# Altium project 一体机V5.PrjPcb (part 2 of 4)

## Sheet 01-USB Device.SchDoc
size A4; DocumentNumber: 21; SheetNumber: 21; SheetTotal: 34
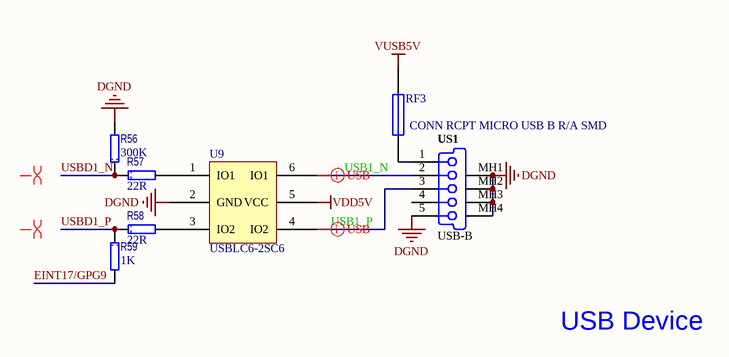
[diagram p12: 01-USB Device.SchDoc]

### Parts
R56  value 300K  [1608[0603]R]  (hidden comment: CRCW0603300KFKEA)
R57  value 22R  [1608[0603]R]  (hidden comment: CRCW060322R0FKEA)
R58  value 22R  [1608[0603]R]  (hidden comment: CRCW060322R0FKEA)
R59  value 1K  [1608[0603]R]  (hidden comment: CRCW06031K00FKEA)
RF3  0805L050WR  [2012[0805]F]  (value not drawn)
U9  USBLC6-2SC6  [SOT26A-6N]
US1  USB-B  Description 1: CONN RCPT MICRO USB B R/A SMD  [USB/SM0.8-6H5]

### Nets
DGND: R56.2 U9.2(GND) US1.5 US1.MH1 US1.MH2 US1.MH3 US1.MH4
VDD5V: U9.5(VCC)
VUSB5V: RF3.2
EINT17/GPG9: R59.2
USB1_N: U9.6(IO1) US1.2
USB1_P: U9.4(IO2) US1.3
USBD1_N: R56.1 R57.1
USBD1_P: R58.1 R59.1
NetR57_2: R57.2 U9.1(IO1)
NetR58_2: R58.2 U9.3(IO2)
NetRF3_1: RF3.1 US1.1

Not connected (* = marked no-connect by the designer): US1 4

### Layout directives
differential pair: (no net found under the mark), USB1_N, USB1_P

### Notes on the sheet
- USB Device

### Library data of the parts
R56 = RES: 厚膜电阻器 - SMD 1/10watt 300Kohms 1%; Manufacturer: Vishay / Dale; 尺寸: 0.85 mm W x 1.55 mm L x 0.45 mm H; 工作温度范围: - 55 C to + 155 C; 封装 / 箱体: 0603 (1608 metric); 封装: Reel; 功率额定值: 100 mW; 产品: Thick Film Resistors SMD; 系列: CRCW; 温度系数: 100 PPM / K; 端接类型: SMD/SMT; 电压额定值: 75 V; 外壳代码 - in: 0603; 外壳代码 - mm: 1608; 制造商: Vishay; 产品种类: 0603 Thick Film Chip Resistors; 标准包装数量: 5000; Supplier 1: Mouser; Supplier Part Number 1: 71-CRCW0603-300K-E3; Manufacturer Part Number: CRCW0603300KFKEA; RoHS: RoHS Compliant By Exemption; Category: 厚膜电阻器 - SMD; Stock 1: 19604; Pricing 1: 1=0.080, 10=0.013, 100=0.010, 1000=0.008, 5000=0.005, 25000=0.004, 50000=0.003 (USD); 电阻: 300 kOhms; 容差: 1 %; RoHS - 贸泽: E; Minimum Order Quantity: 1; Reeling: True; ComponentLink1URL: http://www.mouser.com/ds/2/427/dcrcwe3-109170.pdf; ComponentLink1Description: http://www.mouser.com/ds/2/427/dcrcwe3-109170.pdf; Description 1: 厚膜电阻器 - SMD 1/10watt 300Kohms 1%
R57 R58 = RES: 厚膜电阻器 - SMD 1/10watt 22ohms 1%; Manufacturer: Vishay / Dale; 尺寸: 0.85 mm W x 1.55 mm L x 0.45 mm H; 工作温度范围: - 55 C to + 155 C; 封装 / 箱体: 0603 (1608 metric); 封装: Reel; 功率额定值: 100 mW; 产品: Thick Film Resistors SMD; 系列: CRCW; 温度系数: 100 PPM / K; 端接类型: SMD/SMT; 电压额定值: 75 V; 制造商: Vishay; 标准包装数量: 5000; 外壳代码 - in: 0603; 外壳代码 - mm: 1608; 产品种类: 0603 Thick Film Chip Resistors; Supplier 1: Mouser; Supplier Part Number 1: 71-CRCW0603-22-E3; Manufacturer Part Number: CRCW060322R0FKEA; RoHS: RoHS Compliant By Exemption; Category: 厚膜电阻器 - SMD; Stock 1: 35802; 电阻: 22 Ohms; 容差: 1 %; Minimum Order Quantity: 1; Reeling: True; ComponentLink1URL: http://www.mouser.com/ds/2/427/dcrcwe3-109170.pdf; ComponentLink1Description: http://www.mouser.com/ds/2/427/dcrcwe3-109170.pdf; Description 1: 厚膜电阻器 - SMD 1/10watt 22ohms 1%; Pricing 1: 1=0.080, 10=0.013, 100=0.010, 1000=0.008, 5000=0.005, 25000=0.004, 50000=0.003 (USD); RoHS - 贸泽: E
R59 = RES: 厚膜电阻器 - SMD 1/10watt 1.0Kohms 1%; Manufacturer: Vishay / Dale; 尺寸: 0.85 mm W x 1.55 mm L x 0.45 mm H; 工作温度范围: - 55 C to + 155 C; 封装 / 箱体: 0603 (1608 metric); 封装: Reel; 功率额定值: 100 mW; 产品: Thick Film Resistors SMD; 电阻: 1 kOhms; 系列: CRCW; 温度系数: 100 PPM / K; 端接类型: SMD/SMT; 电压额定值: 75 V; 制造商: Vishay; 产品种类: 0603 Thick Film Chip Resistors; 标准包装数量: 5000; 外壳代码 - in: 0603; 外壳代码 - mm: 1608; Supplier 1: Mouser; Supplier Part Number 1: 71-CRCW0603-1.0K-E3; Manufacturer Part Number: CRCW06031K00FKEA; RoHS: RoHS Compliant By Exemption; Category: 厚膜电阻器 - SMD; Stock 1: 276938; Pricing 1: 1=0.080, 10=0.013, 100=0.010, 1000=0.008, 5000=0.005, 25000=0.004, 50000=0.003 (USD); 容差: 1 %; RoHS - 贸泽: E; Minimum Order Quantity: 1; Reeling: True; ComponentLink1URL: http://www.mouser.com/ds/2/427/dcrcwe3-109170.pdf; ComponentLink1Description: http://www.mouser.com/ds/2/427/dcrcwe3-109170.pdf; Description 1: 厚膜电阻器 - SMD 1/10watt 1.0Kohms 1%
RF3 = FUSE1: 可复位保险丝 PTC 30V POLY SURF MOUNT 0805 .500A; Manufacturer: Littelfuse; Resistance: 850 mOhms; Current Rating (Max): 100 A; Hold Current: 0.5 A; Maximum Voltage: 6 VDC; Trip Current: 1 A; Supplier 1: Mouser; Supplier Part Number 1: 576-0805L050; Manufacturer Part Number: 0805L050WR; RoHS: RoHS Compliant; Category: Resettable Fuses - PPTC; Stock 1: 4103; Pricing 1: 1=3.25, 10=2.61, 50=2.39, 100=2.12, 200=2.07, 500=1.74, 1000=1.49, 3000=1.40, 6000=1.35 (AUD); Dimensions: 2.2 mm L x 1.5 mm W x 1.25 mm  H; Operating Temperature Range: - 40 C to + 85 C; Package / Case: 0805 (2012 metric); Packaging: Reel; Series: 0805L; Termination Style: SMD/SMT; Type: PolyFuse Resettable PTC; Mounting Style: SMD/SMT; Product Category: Resettable PTCs; Standard Pack Qty: 3000; RoHS - Mouser: Y; Minimum Order Quantity: 1; Reeling: True; ComponentLink1URL: http://www.mouser.com/ds/2/240/Littelfuse_0805L-32472.pdf; ComponentLink1Description: http://www.mouser.com/ds/2/240/Littelfuse_0805L-32472.pdf
U9 = USBLC6-2SC6: TVS二极管阵列 ESD Protection Low Cap; Manufacturer: STMicroelectronics; 击穿电压: 6 V; 电容: 3.5 pF; 钳位电压: 17 V; 尺寸: 1.75 (Max) mm W x 3.05 (Max) mm L; 工作电压: 5 V; 封装 / 箱体: SOT-23-6; 封装: Reel; 端接类型: SMD/SMT; 通道: 2 Channels; 峰值浪涌电流: 5 A; 最大工作温度: + 125 C; 最小工作温度: - 40 C; 极性: Bidirectional; 产品种类: Voltage Protection Devices; 标准包装数量: 3000; Supplier 1: Mouser; Supplier Part Number 1: 511-USBLC6-2SC6; Manufacturer Part Number: USBLC6-2SC6; RoHS: RoHS Compliant; Description 1: TVS二极管阵列 ESD Protection Low Cap; Category: TVS二极管阵列; Stock 1: 42706; Pricing 1: 1=0.670, 10=0.590, 100=0.510, 250=0.490, 500=0.460, 1000=0.407, 3000=0.360, 6000=0.321 (USD); 系列: USBLC6-2; 安装风格: SMD/SMT; 制造商: STMicroelectronics; RoHS - 贸泽: Y; Minimum Order Quantity: 1; Reeling: True; ComponentLink1URL: http://www.st.com/web/en/resource/technical/document/datasheet/CD00050750.pdf; ComponentLink1Description: http://www.st.com/web/en/resource/technical/document/datasheet/CD00050750.pdf
US1 = D-300-0034: USB On-The-Go (OTG) Mini-B Receptacle, Right Angle, SMT, 0.80mm (.031") Pitch, Solder Tabs with Back Cover, Recessed Type; Manufacturer: TE Connectivity; Manufacturer Part Number: 1981568-1; Max Current: mA; Number of Contacts: 5; Specifications: USB 1.0; Connector type: Right Angle; Mounting Technology: Surface Mount; Status: Unreleased; Category: Connector; Supplier 1: Digi-Key; Supplier Part Number 1: A97800TR-ND; RoHS: RoHS Compliant; Stock 1: 12000; Pricing 1: 1000=0.9108, 2000=0.88044, 3000=0.85008, 5000=0.80758, 10000=0.78936 (USD); Packaging: Tape & Reel (TR); Gender: Receptacle; Mounting Type: Surface Mount, Right Angle, Horizontal; Features: -; Ingress Protection: -; ComponentLink1URL: http://www.te.com/commerce/DocumentDelivery/DDEController?Action=srchrtrv&DocNm=1981568&DocType=Customer+Drawing&DocLang=English; ComponentLink1Description: http://www.te.com/commerce/DocumentDelivery/DDEController?Action=srchrtrv&DocNm=1981568&DocType=Customer+Drawing&DocLang=English

## Sheet 06-Key.SchDoc
size A4; DocumentNumber: 27; SheetNumber: 27; SheetTotal: 34
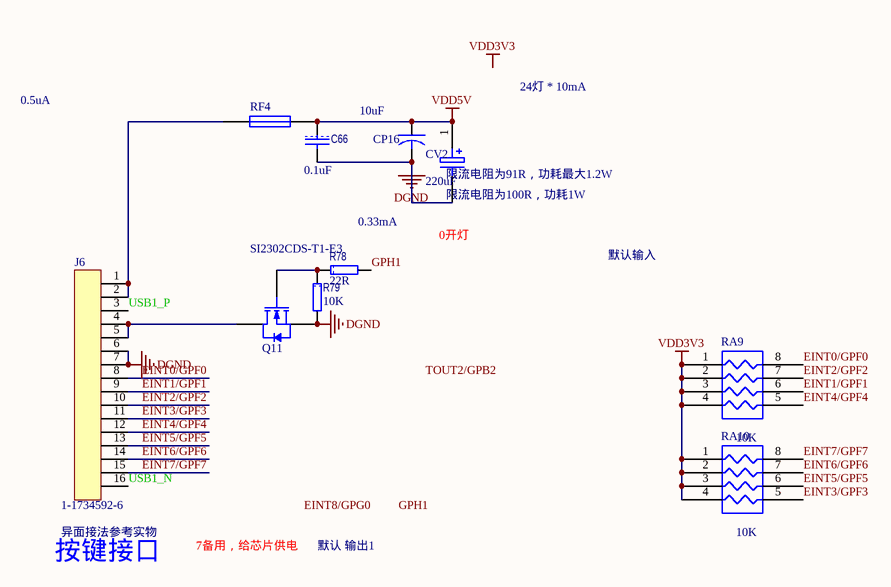
[diagram p13: 06-Key.SchDoc]

### Parts
C66  value 0.1uF  [1608[0603]C]  (hidden comment: C1608X7R1H104K)
CP16  value 10uF  [3216[1206]CB]  (hidden comment: TAJA106K016RNJ)
CV2  value 220uF  [CAPPR5-10x20/H1.1]  (hidden comment: EEU-FM1V221)
J6  1-1734592-6  [FFC/SM0.5-2H16]
Q11  SI2302CDS-T1-E3  [SOT23_N]
R78  value 22R  [1608[0603]R]  (hidden comment: CRCW060322R0FKEA)
R79  value 10K  [1608[0603]R]  (hidden comment: CRCW060310K0FKEA)
RA9  value 10K  [R-AR4]  (hidden comment: CRA06S08310K0JTA)
RA10  value 10K  [R-AR4]  (hidden comment: CRA06S08310K0JTA)
RF4  0805L050WR  [2012[0805]F]  (value not drawn)

### Nets
DGND: C66.2 CP16.2 CV2.2 J6.6 J6.7 Q11.2(S) R79.2
VDD3V3: RA9.1(R1) RA9.2(R2) RA9.3(R3) RA9.4(R4) RA10.1(R1) RA10.2(R2) RA10.3(R3) RA10.4(R4)
VDD5V: C66.1 CP16.1 CV2.1 RF4.2
EINT0/GPF0: J6.8 RA9.8(R1)
EINT1/GPF1: J6.9 RA9.6(R3)
EINT2/GPF2: J6.10 RA9.7(R2)
EINT3/GPF3: J6.11 RA10.5(R4)
EINT4/GPF4: J6.12 RA9.5(R4)
EINT5/GPF5: J6.13 RA10.6(R3)
EINT6/GPF6: J6.14 RA10.7(R2)
EINT7/GPF7: J6.15 RA10.8(R1)
GPH1: R78.2
USB1_N: J6.16
USB1_P: J6.3
NetJ6_1: J6.1 J6.2 RF4.1
NetJ6_4: J6.4 J6.5 Q11.3(D)
NetQ11_1: Q11.1(G) R78.1 R79.1

### Notes on the sheet
- 0.5uA
- 24灯 * 10mA
- (near CV2) 限流电阻为91R，功耗最大1.2W
- (near CV2) 限流电阻为100R，功耗1W
- (near R78) 0.33mA
- 0开灯
- 默认输入
- (near J6) 异面接法参考实物
- 7备用，给芯片供电
- 默认 输出1
- (near J6) 按键接口
- Labels drawn without touching a wire or pin: EINT8/GPG0, GPH1, TOUT2/GPB2, VDD3V3

### Library data of the parts
C66 = CAP: 多层陶瓷电容器MLCC - SMD/SMT 0603 0.1uF 50volts X7R 10%; Manufacturer: TDK; 产品: General Type MLCCs; 产品种类: Low & Medium Capacitance SMD Ceramic Chip Capacitors; 外壳代码 - in: 0603; 外壳代码 - mm: 1608; 封装 / 箱体: 0603 (1608 metric); 封装: Reel; 尺寸: 0.8 mm W x 1.6 mm L x 0.8 mm H; 工作温度范围: - 55 C to + 125 C; 标准包装数量: 4000; 电压额定值: 50 V; 电容-nF: 100 nF; 电容-pF: 100000 pF; 系列: C; Category: 多层陶瓷电容器MLCC - SMD/SMT; ComponentLink1Description: http://www.tdk.com/pdf/general_B11.pdf; ComponentLink1URL: http://www.tdk.com/pdf/general_B11.pdf; Description 1: 多层陶瓷电容器MLCC - SMD/SMT 0603 0.1uF 50volts X7R 10%; Manufacturer Part Number: C1608X7R1H104K; Minimum Order Quantity: 1; Pricing 1: 1=0.160, 50=0.070, 100=0.036, 500=0.019, 1000=0.013, 4000=0.010, 8000=0.009, 12000=0.008, 20000=0.007 (USD); Reeling: True; RoHS - 贸泽: Y; RoHS: RoHS Compliant; Stock 1: 224604; Supplier 1: Mouser; Supplier Part Number 1: 810-C1608X7R1H104K; 制造商: TDK; 容差: 10 %; 温度系数/代码: X7R; 电容: 0.1 uF; 端接类型: SMD/SMT
CP16 = CAPACITOR: 钽质电容器-固体SMD 16volts 10uF 10%; Manufacturer: AVX; ESR: 3 Ohms; 产品: Tantalum Solid Standard Grade - Other Various; 产品种类: SMD Tantalum Capacitors; 制造商库存号: A Case; 外壳代码 - in: 1206; 外壳代码 - mm: 3216; 封装 / 箱体: 1206 (3216 metric); 封装: Reel; 尺寸: 1.6 mm W x 3.2 mm L; 工作温度范围: - 55 C to + 125 C; 损耗因数 DF: 8; 标准包装数量: 2000; 漏泄电流: 1.6 uA; 电压额定值: 16 V; 端接类型: SMD/SMT; 系列: TAJ; 高度: 1.8 mm; Category: 钽质电容器-固体SMD; ComponentLink1Description: http://www.avx.com/docs/Catalogs/taj.pdf; ComponentLink1URL: http://www.avx.com/docs/Catalogs/taj.pdf; Description 1: 钽质电容器-固体SMD 16volts 10uF 10%; Manufacturer Part Number: TAJA106K016RNJ; Minimum Order Quantity: 1; Pricing 1: 1=0.600, 100=0.280, 200=0.250, 500=0.221, 1000=0.200, 2000=0.140, 5000=0.131, 10000=0.124, 25000=0.103 (USD); Reeling: True; RoHS - 贸泽: Y; RoHS: RoHS Compliant; Stock 1: 20335; Supplier 1: Mouser; Supplier Part Number 1: 581-TAJA106K016R; 制造商: AVX; 容差: 10 %; 电容: 10 uF
CV2 = ELECTRO1: 插针 铝质电解电容器 - 带引线 220UF 35V ELECT FM RADIAL; Manufacturer: Panasonic Electronic Components; Manufacturer Part Number: EEU-FM1V471; Description 1: 铝质电解电容器 - 带引线 470UF 35V ELECT FM RADIAL; 电容: 470 uF; 工作温度范围: - 40 C to + 105 C; 封装: Bulk; 产品: General Purpose Electrolytic Capacitors; 容差: 20 %; 外壳直径: 10 mm; 外壳长度: 20 mm; 引线间隔: 5 mm; 制造商: Panasonic; 标准包装数量: 200; Supplier 1: Mouser; Supplier Part Number 1: 667-EEU-FM1V471; RoHS: RoHS Compliant; Category: 铝质电解电容器 - 带引线; Stock 1: 8429; Pricing 1: 1=0.300, 25=0.281, 100=0.258, 250=0.238, 500=0.230, 1000=0.226, 2000=0.216, 5000=0.200 (USD); 系列: FM; 端接类型: Radial; 电压额定值: 35 V; RoHS - 贸泽: Y; Minimum Order Quantity: 1; Reeling: False; ComponentLink1URL: http://www.mouser.com/ds/2/315/ABA0000CE108-5973.pdf; ComponentLink1Description: http://www.mouser.com/ds/2/315/ABA0000CE108-5973.pdf
J6 = 16PIN: TE CONNECTIVITY / AMP - 1-1734592-6 - FFC/FPC CONNECTOR, RECEPTACLE 16POS 1ROW; Pitch Spacing: 0.5; No. of Contacts: 16; No. of Rows: 1; FFC / FPC Thickness: 0.3; Contact Termination: Surface Mount Right Angle; Supplier 1: Newark; Supplier Part Number 1: 16R9533; Manufacturer: TE CONNECTIVITY / AMP; Manufacturer Part Number: 1-1734592-6; RoHS: YES; Description 1: TE CONNECTIVITY / AMP - 1-1734592-6 - FFC/FPC CONNECTOR, RECEPTACLE 16POS 1ROW; Stock 1: 219; Pricing 1: 1=0.383, 25=0.383, 50=0.383, 100=0.328, 500=0.328, 1000=0.328, 2500=0.297 (USD); Series: -; Gender: Receptacle; Contact Plating: Gold; ComponentLink1URL: http://www.tycoelectronics.com/commerce/DocumentDelivery/DDEController?Action=srchrtrv&DocNm=1-1773440-6&DocType=Data+Sheet&DocLang=English; ComponentLink1Description: http://www.tycoelectronics.com/commerce/DocumentDelivery/DDEController?Action=srchrtrv&DocNm=1-1773440-6&DocType=Data+Sheet&DocLang=English; ComponentLink2URL: http://www.farnell.com/cad/1650059.pdf; ComponentLink2Description: http://www.farnell.com/cad/1650059.pdf; ComponentLink3URL: http://www.farnell.com/datasheets/1665333.pdf; ComponentLink3Description: http://www.farnell.com/datasheets/1665333.pdf
Q11 = 2N7002: MOSFET 20V 2.9A 0.86W 57mohm @ 4.5V; Manufacturer: Vishay / Siliconix; 配置: Single; 封装 / 箱体: SOT-23-3; 封装: Reel; 漏极连续电流: 2.6 A; 闸/源击穿电压: +/- 8 V; 安装风格: SMD/SMT; 功率耗散: 710 mW; 电阻汲极/源极 RDS（导通）: 0.057 Ohms; 晶体管极性: N-Channel; 下降时间: 7 ns; 制造商: Vishay; 最大工作温度: + 150 C; 最小工作温度: - 55 C; 产品种类: N-Channel MOSFETs; 标准包装数量: 3000; 典型关闭延迟时间: 30 ns; Supplier 1: Mouser; Supplier Part Number 1: 781-SI2302CDS-E3; Manufacturer Part Number: SI2302CDS-T1-E3; RoHS: RoHS Compliant; Description 1: MOSFET 20V 2.9A 0.86W 57mohm @ 4.5V; Category: MOSFET; Stock 1: 51301; Pricing 1: 1=0.150, 10=0.140, 100=0.130, 250=0.125, 500=0.120, 1000=0.115, 3000=0.110, 6000=0.105, 12000=0.100 (USD); 汲极/源极击穿电压: 20 V; 上升时间: 7 ns; RoHS - 贸泽: Y; Minimum Order Quantity: 1; Reeling: True; ComponentLink1URL: http://www.vishay.com/doc?68645; ComponentLink1Description: http://www.vishay.com/doc?68645
R78 = RES: as R57 on sheet 01-USB Device; Supplier 1: Mouser; Supplier Part Number 1: 71-CRCW0603-22-E3; Manufacturer Part Number: CRCW060322R0FKEA; RoHS: RoHS Compliant By Exemption; Category: 厚膜电阻器 - SMD; Stock 1: 35802; 电阻: 22 Ohms; 容差: 1 %; Minimum Order Quantity: 1; Reeling: True; ComponentLink1URL: http://www.mouser.com/ds/2/427/dcrcwe3-109170.pdf; ComponentLink1Description: http://www.mouser.com/ds/2/427/dcrcwe3-109170.pdf; Description 1: 厚膜电阻器 - SMD 1/10watt 22ohms 1%; Pricing 1: 1=0.080, 10=0.013, 100=0.010, 1000=0.008, 5000=0.005, 25000=0.004, 50000=0.003 (USD); RoHS - 贸泽: E
R79 = RES: 厚膜电阻器 - SMD 1/10watt 10Kohms 1%; Manufacturer: Vishay / Dale; 尺寸: 0.85 mm W x 1.55 mm L x 0.45 mm H; 工作温度范围: - 55 C to + 155 C; 封装 / 箱体: 0603 (1608 metric); 封装: Reel; 功率额定值: 100 mW; 产品: Thick Film Resistors SMD; 系列: CRCW; 温度系数: 100 PPM / K; 端接类型: SMD/SMT; 电压额定值: 75 V; 制造商: Vishay; 产品种类: 0603 Thick Film Chip Resistors; 标准包装数量: 5000; 外壳代码 - in: 0603; 外壳代码 - mm: 1608; Supplier 1: Mouser; Supplier Part Number 1: 71-CRCW0603-10K-E3; Manufacturer Part Number: CRCW060310K0FKEA; RoHS: RoHS Compliant By Exemption; Category: 厚膜电阻器 - SMD; Stock 1: 0; Pricing 1: 1=0.080, 10=0.013, 100=0.010, 1000=0.008, 5000=0.005, 25000=0.004, 50000=0.003 (USD); 电阻: 10 kOhms; 容差: 1 %; RoHS - 贸泽: E; Minimum Order Quantity: 1; Reeling: True; ComponentLink1URL: http://www.mouser.com/ds/2/427/dcrcwe3-109170.pdf; ComponentLink1Description: http://www.mouser.com/ds/2/427/dcrcwe3-109170.pdf; Description 1: 厚膜电阻器 - SMD 1/10watt 10Kohms 1%
RA9 RA10 = RP4R: 电阻器网络与阵列 8Term 10Kohms 5% Convex; Manufacturer: Vishay / Dale; 尺寸: 1.5 mm W x 1.6 mm L x 0.5 mm H; 工作温度范围: - 55 C to + 150 C; 封装: Reel; 系列: CRA06; 温度系数: 200 PPM / K; 端接类型: SMD/SMT; 电路类型: Isolated; 管脚数量: 8; 电阻器数量: 4; 引线间隔: 0.8 mm; 制造商: Vishay; 产品种类: Thick Film Resistor Arrays; 产品类型: Arrays; Supplier 1: Mouser; Supplier Part Number 1: 71-CRA06S-J-10K; Manufacturer Part Number: CRA06S08310K0JTA; RoHS: RoHS Compliant By Exemption; Description 1: 电阻器网络与阵列 8Term 10Kohms 5% Convex; Category: 电阻器网络与阵列; Stock 1: 11624; Pricing 1: 1=0.090, 100=0.080, 500=0.070, 1000=0.056, 5000=0.051, 10000=0.050, 25000=0.044 (USD); 容差: 5 %; 电阻数值: 10 kOhms; RoHS - 贸泽: E; Minimum Order Quantity: 1; Reeling: True; ComponentLink1URL: http://www.mouser.com/ds/2/427/cra06es-73101.pdf; ComponentLink1Description: http://www.mouser.com/ds/2/427/cra06es-73101.pdf
RF4 = FUSE1: 可复位保险丝 PTC 30V POLY SURF MOUNT 0805.500A; Manufacturer: Littelfuse; Resistance: 850 mOhms; Current Rating (Max): 100 A; Hold Current: 0.5 A; Maximum Voltage: 6 VDC; Trip Current: 1 A; Supplier 1: Mouser; Supplier Part Number 1: 576-0805L050; Manufacturer Part Number: 0805L050WR; RoHS: RoHS Compliant; Category: Resettable Fuses - PPTC; Stock 1: 4103; Pricing 1: 1=3.25, 10=2.61, 50=2.39, 100=2.12, 200=2.07, 500=1.74, 1000=1.49, 3000=1.40, 6000=1.35 (AUD); Dimensions: 2.2 mm L x 1.5 mm W x 1.25 mm  H; Operating Temperature Range: - 40 C to + 85 C; Package / Case: 0805 (2012 metric); Packaging: Reel; Series: 0805L; Termination Style: SMD/SMT; Type: PolyFuse Resettable PTC; Mounting Style: SMD/SMT; Product Category: Resettable PTCs; Standard Pack Qty: 3000; RoHS - Mouser: Y; Minimum Order Quantity: 1; Reeling: True; ComponentLink1URL: http://www.mouser.com/ds/2/240/Littelfuse_0805L-32472.pdf; ComponentLink1Description: http://www.mouser.com/ds/2/240/Littelfuse_0805L-32472.pdf

## Sheet 08-IIC.SchDoc
size A4; DocumentNumber: 29; SheetNumber: 29; SheetTotal: 34
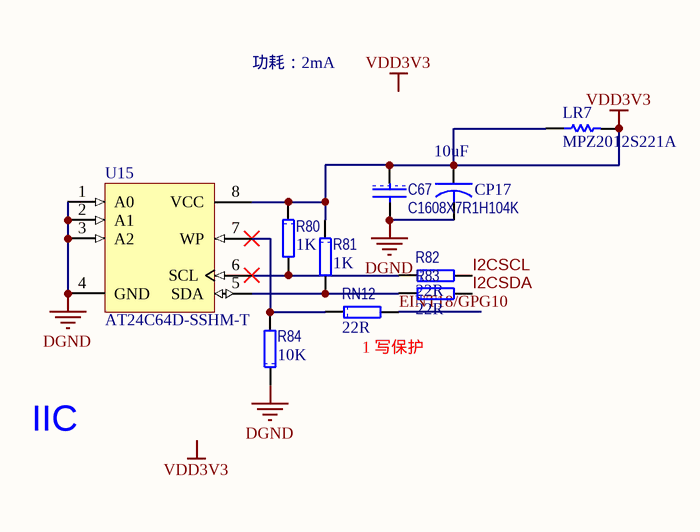
[diagram p14: 08-IIC.SchDoc]

### Parts
C67  C1608X7R1H104K  [1608[0603]C]
CP17  value 10uF  [3216[1206]CB]  (hidden comment: TAJA106K016RNJ)
LR7  MPZ2012S221A  [2012[0805]]
R80  value 1K  [1608[0603]R]  (hidden comment: CRCW06031K00FKEA)
R81  value 1K  [1608[0603]R]  (hidden comment: CRCW06031K00FKEA)
R82  value 22R  [1608[0603]R]  (hidden comment: CRCW060322R0FKEA)
R83  value 22R  [1608[0603]R]  (hidden comment: CRCW060322R0FKEA)
R84  value 10K  [1608[0603]R]  (hidden comment: CRCW060310K0FKEA)
RN12  value 22R  [1608[0603]RN]  (hidden comment: CRCW060322R0FKEA)
U15  AT24C64D-SSHM-T  [SOIC8_N]

### Nets
DGND: C67.2 CP17.2 R84.1 U15.1(A0) U15.2(A1) U15.3(A2) U15.4(GND)
VDD3V3: C67.1 CP17.1 LR7.1 LR7.2 R80.1 R81.1 U15.8(VCC)
EINT18/GPG10: RN12.2
I2CSCL: R82.2
I2CSDA: R83.2
NetR80_2: R80.2 R82.1 U15.6(SCL)
NetR81_2: R81.2 R83.1 U15.5(SDA)
NetR84_2: R84.2 RN12.1 U15.7(WP)

### Notes on the sheet
- 功耗：2mA
- (near RN12) 1 写保护
- IIC
- Labels drawn without touching a wire or pin: VDD3V3

### Library data of the parts
C67 = CAP: as C66 on sheet 06-Key; Value: 0.1uF; Category: 多层陶瓷电容器MLCC - SMD/SMT; ComponentLink1Description: http://www.tdk.com/pdf/general_B11.pdf; ComponentLink1URL: http://www.tdk.com/pdf/general_B11.pdf; Description 1: 多层陶瓷电容器MLCC - SMD/SMT 0603 0.1uF 50volts X7R 10%; Manufacturer Part Number: C1608X7R1H104K; Minimum Order Quantity: 1; Pricing 1: 1=0.160, 50=0.070, 100=0.036, 500=0.019, 1000=0.013, 4000=0.010, 8000=0.009, 12000=0.008, 20000=0.007 (USD); Reeling: True; RoHS - 贸泽: Y; RoHS: RoHS Compliant; Stock 1: 224604; Supplier 1: Mouser; Supplier Part Number 1: 810-C1608X7R1H104K; 制造商: TDK; 容差: 10 %; 温度系数/代码: X7R; 电容: 0.1 uF; 端接类型: SMD/SMT
CP17 = CAPACITOR: as CP16 on sheet 06-Key; Category: 钽质电容器-固体SMD; ComponentLink1Description: http://www.avx.com/docs/Catalogs/taj.pdf; ComponentLink1URL: http://www.avx.com/docs/Catalogs/taj.pdf; Description 1: 钽质电容器-固体SMD 16volts 10uF 10%; Manufacturer Part Number: TAJA106K016RNJ; Minimum Order Quantity: 1; Pricing 1: 1=0.600, 100=0.280, 200=0.250, 500=0.221, 1000=0.200, 2000=0.140, 5000=0.131, 10000=0.124, 25000=0.103 (USD); Reeling: True; RoHS - 贸泽: Y; RoHS: RoHS Compliant; Stock 1: 20335; Supplier 1: Mouser; Supplier Part Number 1: 581-TAJA106K016R; 制造商: AVX; 容差: 10 %; 电容: 10 uF
LR7 = Res Semi: 电磁干扰滤波珠子、扼流圈和阵列 Ferrite Chip Beads; Manufacturer: TDK; 阻抗: 220 Ohms; 最大直流电流: 3 A; 最大直流电阻: 0.04 Ohms; 工作温度范围: - 55 C to + 125 C; 封装 / 箱体: 2012; 封装: Reel; 端接类型: SMD/SMT; 容差: 25 %; 产品种类: Ferrite Beads; 标准包装数量: 4000; Supplier 1: Mouser; Supplier Part Number 1: 810-MPZ2012S221A; Manufacturer Part Number: MPZ2012S221A; RoHS: RoHS Compliant; Description 1: 电磁干扰滤波珠子、扼流圈和阵列 Ferrite Chip Beads; Category: 电磁干扰滤波珠子、扼流圈和阵列; Stock 1: 26540; Pricing 1: 1=0.070, 50=0.060, 100=0.053, 500=0.040, 1000=0.035, 4000=0.031, 8000=0.029, 12000=0.025 (USD); 制造商: TDK; RoHS - 贸泽: Y; Minimum Order Quantity: 1; Reeling: True; ComponentLink1URL: http://www.mouser.com/ds/2/400/e9413_mpz-24582.pdf; ComponentLink1Description: http://www.mouser.com/ds/2/400/e9413_mpz-24582.pdf
R80 R81 = RES: as R59 on sheet 01-USB Device; Supplier 1: Mouser; Supplier Part Number 1: 71-CRCW0603-1.0K-E3; Manufacturer Part Number: CRCW06031K00FKEA; RoHS: RoHS Compliant By Exemption; Category: 厚膜电阻器 - SMD; Stock 1: 276938; Pricing 1: 1=0.080, 10=0.013, 100=0.010, 1000=0.008, 5000=0.005, 25000=0.004, 50000=0.003 (USD); 容差: 1 %; RoHS - 贸泽: E; Minimum Order Quantity: 1; Reeling: True; ComponentLink1URL: http://www.mouser.com/ds/2/427/dcrcwe3-109170.pdf; ComponentLink1Description: http://www.mouser.com/ds/2/427/dcrcwe3-109170.pdf; Description 1: 厚膜电阻器 - SMD 1/10watt 1.0Kohms 1%
R82 R83 RN12 = RES: as R57 on sheet 01-USB Device; Supplier 1: Mouser; Supplier Part Number 1: 71-CRCW0603-22-E3; Manufacturer Part Number: CRCW060322R0FKEA; RoHS: RoHS Compliant By Exemption; Category: 厚膜电阻器 - SMD; Stock 1: 35802; 电阻: 22 Ohms; 容差: 1 %; Minimum Order Quantity: 1; Reeling: True; ComponentLink1URL: http://www.mouser.com/ds/2/427/dcrcwe3-109170.pdf; ComponentLink1Description: http://www.mouser.com/ds/2/427/dcrcwe3-109170.pdf; Description 1: 厚膜电阻器 - SMD 1/10watt 22ohms 1%; Pricing 1: 1=0.080, 10=0.013, 100=0.010, 1000=0.008, 5000=0.005, 25000=0.004, 50000=0.003 (USD); RoHS - 贸泽: E
R84 = RES: as R79 on sheet 06-Key; Supplier 1: Mouser; Supplier Part Number 1: 71-CRCW0603-10K-E3; Manufacturer Part Number: CRCW060310K0FKEA; RoHS: RoHS Compliant By Exemption; Category: 厚膜电阻器 - SMD; Stock 1: 0; Pricing 1: 1=0.080, 10=0.013, 100=0.010, 1000=0.008, 5000=0.005, 25000=0.004, 50000=0.003 (USD); 电阻: 10 kOhms; 容差: 1 %; RoHS - 贸泽: E; Minimum Order Quantity: 1; Reeling: True; ComponentLink1URL: http://www.mouser.com/ds/2/427/dcrcwe3-109170.pdf; ComponentLink1Description: http://www.mouser.com/ds/2/427/dcrcwe3-109170.pdf; Description 1: 厚膜电阻器 - SMD 1/10watt 10Kohms 1%
U15 = AT24C02BN-SP25-T: 电可擦除可编程只读存储器 64K 2-WIRE 1.7V; Manufacturer: Atmel; Description 1: 电可擦除可编程只读存储器 SERIAL 电可擦除可编程只读存储器 64K 2-WIRE 1.7V; 访问时间: 550 ns; 存储容量: 64 Kbit; 组织: 8192 x 8; 封装 / 箱体: SOIC-8; 封装: Reel; 接口类型: 2-Wire Serial; 安装风格: SMD/SMT; 工作电流: 0.4 mA; 数据保留: 100 yr; 最大时钟频率: 1000 kHz; 最大工作电流: 1 mA; 最大工作温度: + 85 C; 最小工作温度: - 40 C; 工作电源电压: 1.7 V to 5.5 V; 标准包装数量: 4000; 电源电压-最大: 5.5 V; Supplier 1: Mouser; Supplier Part Number 1: 556-AT24C64D-SSHM-T; Manufacturer Part Number: AT24C64D-SSHM-T; RoHS: RoHS Compliant; Category: 电可擦除可编程只读存储器; Stock 1: 1653; Pricing 1: 1=0.580, 10=0.480, 25=0.364, 100=0.329, 1000=0.324, 4000=0.324 (USD); 制造商: Atmel; 电源电压-最小: 1.7 V; RoHS - 贸泽: Y; Minimum Order Quantity: 1; Reeling: True; ComponentLink1URL: http://www.mouser.com/ds/2/36/doc8717-54521.pdf; ComponentLink1Description: http://www.mouser.com/ds/2/36/doc8717-54521.pdf

## Sheet 11-SPI.SchDoc
size A4; DocumentNumber: 24; SheetNumber: 24; SheetTotal: 34
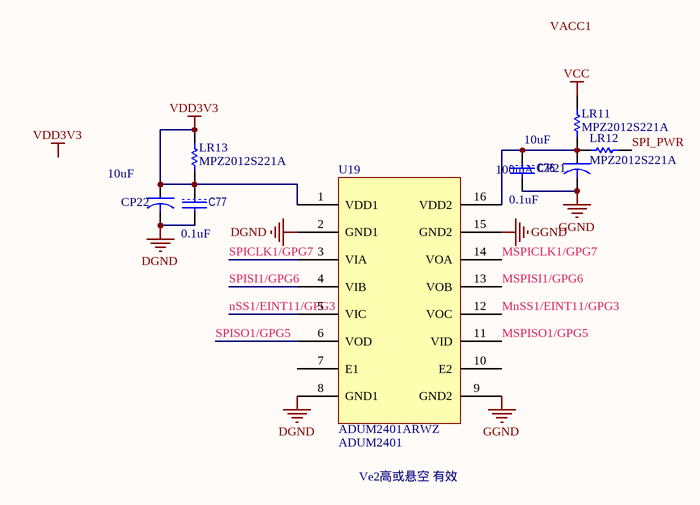
[diagram p15: 11-SPI.SchDoc]

### Parts
C76  value 0.1uF  [1608[0603]C]  (hidden comment: C1608X7R1H104K)
C77  value 0.1uF  [1608[0603]C]  (hidden comment: C1608X7R1H104K)
CP21  value 10uF  [3216[1206]CB]  (hidden comment: TAJA106K016RNJ)
CP22  value 10uF  [3216[1206]CB]  (hidden comment: TAJA106K016RNJ)
LR11  MPZ2012S221A  [2012[0805]]
LR12  MPZ2012S221A  [2012[0805]]
LR13  MPZ2012S221A  [2012[0805]]
U19  ADUM2401ARWZ  [SOIC16W_N]

### Nets
DGND: C77.2 CP22.2 U19.2(GND1) U19.8(GND1)
GGND: C76.2 CP21.2 U19.9(GND2) U19.15(GND2)
VCC: LR11.2
VDD3V3: C77.1 CP22.1 LR13.1 LR13.2 U19.1(VDD1)
MnSS1/EINT11/GPG3: U19.12(VOC)
MSPICLK1/GPG7: U19.14(VOA)
MSPISI1/GPG6: U19.13(VOB)
MSPISO1/GPG5: U19.11(VID)
nSS1/EINT11/GPG3: U19.5(VIC)
SPI_PWR: LR12.1  [project net P8_6]
SPICLK1/GPG7: U19.3(VIA)
SPISI1/GPG6: U19.4(VIB)
SPISO1/GPG5: U19.6(VOD)
NetC76_1: C76.1 CP21.1 LR11.1 LR12.2 U19.16(VDD2)

Not connected (* = marked no-connect by the designer): U19 7(E1) 10(E2)

### Notes on the sheet
- (near C76) 100mA
- Ve2高或悬空 有效
- Labels drawn without touching a wire or pin: VACC1, VDD3V3

### Library data of the parts
C76 C77 = CAP: as C66 on sheet 06-Key; Category: 多层陶瓷电容器MLCC - SMD/SMT; ComponentLink1Description: http://www.tdk.com/pdf/general_B11.pdf; ComponentLink1URL: http://www.tdk.com/pdf/general_B11.pdf; Description 1: 多层陶瓷电容器MLCC - SMD/SMT 0603 0.1uF 50volts X7R 10%; Manufacturer Part Number: C1608X7R1H104K; Minimum Order Quantity: 1; Pricing 1: 1=0.160, 50=0.070, 100=0.036, 500=0.019, 1000=0.013, 4000=0.010, 8000=0.009, 12000=0.008, 20000=0.007 (USD); Reeling: True; RoHS - 贸泽: Y; RoHS: RoHS Compliant; Stock 1: 224604; Supplier 1: Mouser; Supplier Part Number 1: 810-C1608X7R1H104K; 制造商: TDK; 容差: 10 %; 温度系数/代码: X7R; 电容: 0.1 uF; 端接类型: SMD/SMT
CP21 CP22 = CAPACITOR: as CP16 on sheet 06-Key; Category: 钽质电容器-固体SMD; ComponentLink1Description: http://www.avx.com/docs/Catalogs/taj.pdf; ComponentLink1URL: http://www.avx.com/docs/Catalogs/taj.pdf; Description 1: 钽质电容器-固体SMD 16volts 10uF 10%; Manufacturer Part Number: TAJA106K016RNJ; Minimum Order Quantity: 1; Pricing 1: 1=0.600, 100=0.280, 200=0.250, 500=0.221, 1000=0.200, 2000=0.140, 5000=0.131, 10000=0.124, 25000=0.103 (USD); Reeling: True; RoHS - 贸泽: Y; RoHS: RoHS Compliant; Stock 1: 20335; Supplier 1: Mouser; Supplier Part Number 1: 581-TAJA106K016R; 制造商: AVX; 容差: 10 %; 电容: 10 uF
LR11-LR13 = Res Semi: as LR7 on sheet 08-IIC; Supplier 1: Mouser; Supplier Part Number 1: 810-MPZ2012S221A; Manufacturer Part Number: MPZ2012S221A; RoHS: RoHS Compliant; Description 1: 电磁干扰滤波珠子、扼流圈和阵列 Ferrite Chip Beads; Category: 电磁干扰滤波珠子、扼流圈和阵列; Stock 1: 26540; Pricing 1: 1=0.070, 50=0.060, 100=0.053, 500=0.040, 1000=0.035, 4000=0.031, 8000=0.029, 12000=0.025 (USD); 制造商: TDK; RoHS - 贸泽: Y; Minimum Order Quantity: 1; Reeling: True; ComponentLink1URL: http://www.mouser.com/ds/2/400/e9413_mpz-24582.pdf; ComponentLink1Description: http://www.mouser.com/ds/2/400/e9413_mpz-24582.pdf
U19 = ADuM2401: ADuM2401 1IN 3OUT; Manufacturer: Analog Devices; Isolation Voltage: 846 V; Supply Current: 0.53 mA; Number of Channels: 4 Channel; Number of Input Lines: 3; Maximum Data Rate: 1 Mbps; Propagation Delay Time: 32 ns; Supply Voltage - Max: 5.5 V; Supply Voltage - Min: 2.7 V; Product Status: New at Mouser; Supplier 1: Mouser; Manufacturer Part Number: ADUM2401ARWZ; RoHS: RoHS Compliant; Category: Isolator Interface IC; Stock 1: 339; Pricing 1: 1=9.54, 10=8.59, 25=7.82, 50=7.29, 100=7.06, 250=6.48, 500=5.91, 1000=5.16, 2500=5.09 (AUD); Package / Case: SOIC-16; Packaging: Tube; Mounting Style: SMD/SMT; Maximum Operating Temperature: + 105 C; Minimum Operating Temperature: - 40 C; Standard Pack Qty: 47; RoHS - Mouser: Y; Minimum Order Quantity: 1; Reeling: False; ComponentLink1URL: http://www.analog.com/static/imported-files/data_sheets/ADuM2400_2401_2402.pdf; ComponentLink1Description: http://www.analog.com/static/imported-files/data_sheets/ADuM2400_2401_2402.pdf; Supplier Part Number 1: 584-ADUM2401ARWZ; Series: ADUM2401

## Sheet GPS总图.SchDoc
size A4; DocumentNumber: 20; SheetNumber: 20; SheetTotal: 34
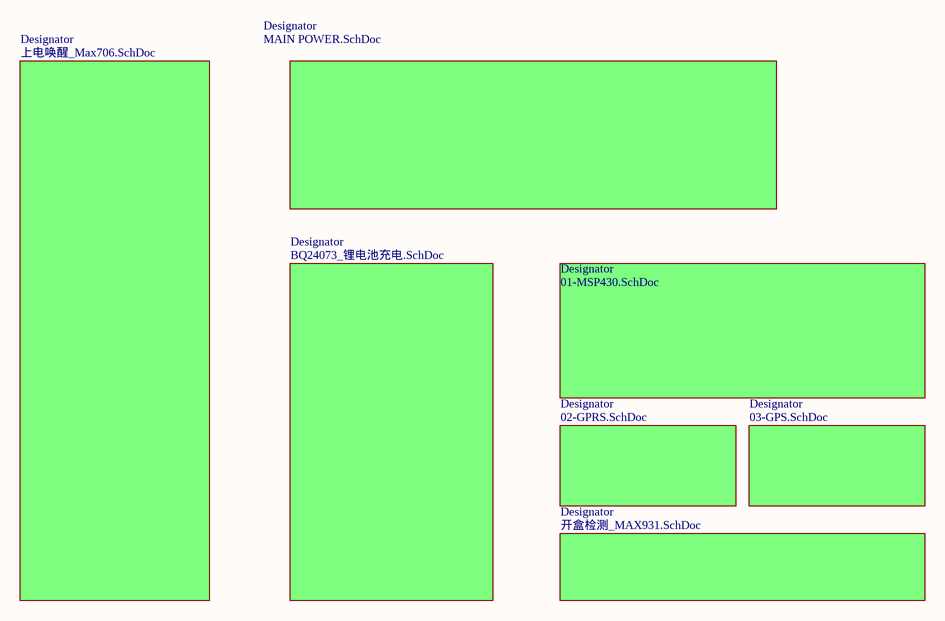
[diagram p16: GPS总图.SchDoc]

### Sub-sheets
Designator = 01-MSP430.SchDoc: no entries
Designator = 02-GPRS.SchDoc: no entries
Designator = 03-GPS.SchDoc: no entries
Designator = BQ24073_锂电池充电.SchDoc: no entries
Designator = 开盒检测_MAX931.SchDoc: no entries
Designator = MAIN POWER.SchDoc: no entries
Designator = 上电唤醒_Max706.SchDoc: no entries

## Sheet 01-MSP430.SchDoc
size A4; DocumentNumber: 17; SheetNumber: 17; SheetTotal: 34
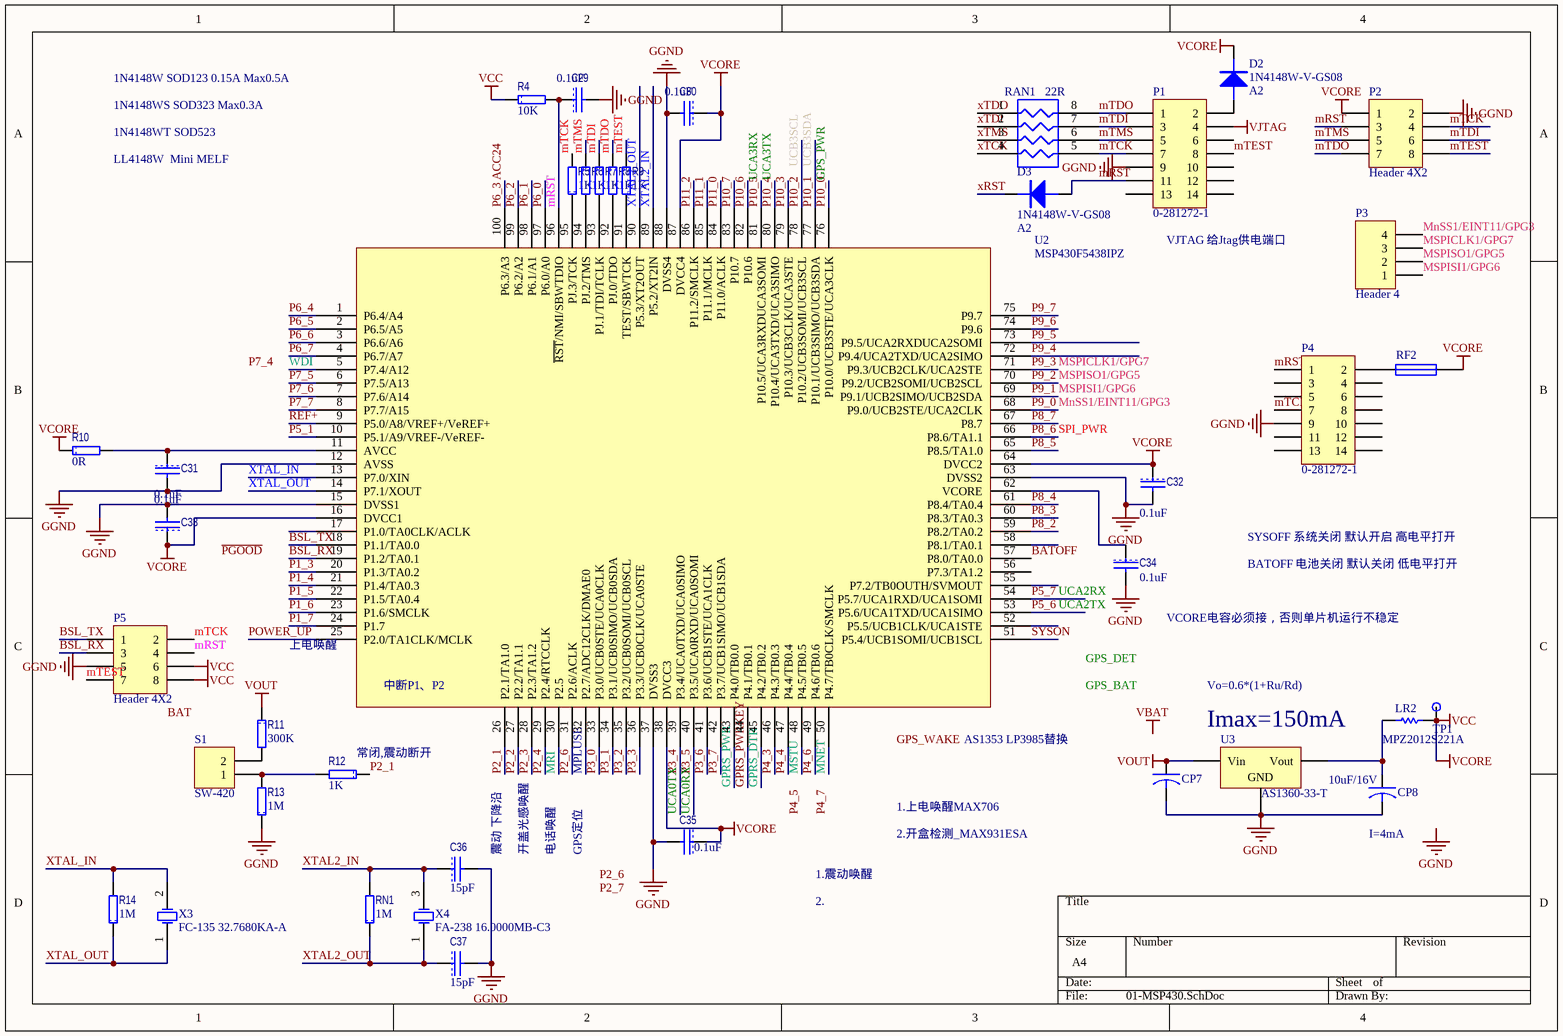
[diagram p17: 01-MSP430.SchDoc]

### Parts
C29  value 0.1uF  [1608[0603]C]  (hidden comment: C1608X7R1H104K)
C30  value 0.1uF  [1608[0603]C]  (hidden comment: C1608X7R1H104K)
C31  value 0.1uF  [1608[0603]C]  (hidden comment: C1608X7R1H104K)
C32  value 0.1uF  [1608[0603]C]  (hidden comment: C1608X7R1H104K)
C33  value 0.1uF  [1608[0603]C]  (hidden comment: C1608X7R1H104K)
C34  value 0.1uF  [1608[0603]C]  (hidden comment: C1608X7R1H104K)
C35  value 0.1uF  [1608[0603]C]  (hidden comment: C1608X7R1H104K)
C36  value 15pF  [1608[0603]]  (hidden comment: C1608C0G1H150J)
C37  value 15pF  [1608[0603]]  (hidden comment: C1608C0G1H150J)
CP7  TAJA106K016RNJ  [3216[1206]CB]  (value not drawn)
CP8  value 10uF/16V  [3216[1206]CB]  (hidden comment: TAJA106K016RNJ)
D2  1N4148W-V-GS08  value A2  [SOD123]
D3  1N4148W-V-GS08  value A2  [SOD123]
LR2  MPZ2012S221A  [2012[0805]]
P1  0-281272-1  [HDR2X7]
P2  Header 4X2  [HDR2X4]
P3  Header 4  [HDR1X4]
P4  0-281272-1  [HDR2X7]
P5  Header 4X2  [HDR2X4]
R4  value 10K  [1608[0603]R]  (hidden comment: CRCW060310K0FKEA)
R5  value 1K  [1608[0603]R]  (hidden comment: CRCW06031K00FKEA)
R6  value 1K  [1608[0603]R]  (hidden comment: CRCW06031K00FKEA)
R7  value 1K  [1608[0603]R]  (hidden comment: CRCW06031K00FKEA)
R8  value 1K  [1608[0603]R]  (hidden comment: CRCW06031K00FKEA)
R9  value 1K  [1608[0603]R]  (hidden comment: CRCW06031K00FKEA)
R10  value 0R  [1608[0603]R]  (hidden comment: CRCW06030000ZSTA)
R11  value 300K  [1608[0603]R]  (hidden comment: CRCW0603300KFKEA)
R12  value 1K  [1608[0603]R]  (hidden comment: CRCW06031K00FKEA)
R13  value 1M  [1608[0603]R]  (hidden comment: CRCW06031M00FKEA)
R14  value 1M  [1608[0603]R]  (hidden comment: CRCW06031M00FKEA)
RAN1  value 22R  [R-AR4]  (hidden comment: CRA06S08322R0JTA)
RF2  0805L050WR  [2012[0805]F]  (value not drawn)
RN1  value 1M  [1608[0603]RN]  (hidden comment: CRCW06031M00FKEA)
S1  SW-420  [SW-420]
TP1  TP  [TP]  (value not drawn)
U2  MSP430F5438IPZ  [TQFP100_N]
U3  AS1360-33-T  [SOT23_N]
X3  FC-135 32.7680KA-A  [FC-135]
X4  FA-238 16.0000MB-C3  [FA-238]

### Nets
GGND: C29.2 C30.2 C31.2 C32.2 C33.2 C34.2 C35.2 C36.2 C37.2 CP7.2 CP8.2 P1.9 P2.2 P4.9 P5.5 R13.1 U2.12(AVSS) U2.15(DVSS1) U2.37(DVSS3) U2.63(DVSS2) U2.88(DVSS4) U3.1(GND)
VCC: C30.1 C32.1 C33.1 C35.1 D2.2(K) LR2.1 P2.1 P5.6 P5.8 R4.1 R10.1 RF2.2 TP1.1(TestPoint) U2.16(DVCC1) U2.38(DVCC3) U2.64(DVCC2) U2.87(DVCC4)  [also labelled VCORE]
VJTAG: P1.4
VOUT: CP7.1 R11.1 U3.3(Vin)
ACC24: U2.100(P6.3/A3)  [also labelled P6_3]
BATOFF: U2.57(P8.0/TA0.0)
BSL_RX: P5.3 U2.19(P1.2/TA0.1)
BSL_TX: P5.1 U2.18(P1.1/TA0.0)
GPRS_DTR: U2.45(P4.2/TB0.2)
GPRS_PWR: U2.43(P4.0/TB0.0)
GPRS_PWRKEY: U2.44(P4.1/TB0.1)
GPS_PWR: U2.76(P10.0/UCB3STE/UCA3CLK)  [also labelled P10_0]
MNET: U2.50(P4.7/TB0CLK/SMCLK)
MnSS1/EINT11/GPG3: P3.4 U2.68(P9.0/UCB2STE/UCA2CLK)  [also labelled P9_0]
MPLUSE: U2.32(P2.7/ADC12CLK/DMAE0)
MRI: U2.30(P2.5)
mRST: C29.1 D3.1(A) P1.11 P2.3 P4.1 P5.4 R4.2 U2.96(~{RST}/NMI/SBWTDIO)
MSPICLK1/GPG7: P3.3 U2.71(P9.3/UCB2CLK/UCA2STE)  [also labelled P9_3]
MSPISI1/GPG6: P3.1 U2.69(P9.1/UCB2SIMO/UCB2SDA)  [also labelled P9_1]
MSPISO1/GPG5: P3.2 U2.70(P9.2/UCB2SOMI/UCB2SCL)  [also labelled P9_2]
MSTU: U2.48(P4.5/TB0.5)
mTCK: P1.7 P2.4 P4.7 P5.2 R5.2 RAN1.5(R4)
mTDI: P1.3 P2.6 R7.1 RAN1.7(R2)
mTDO: P1.1 P2.7 R8.1 RAN1.8(R1)
mTEST: P1.8 P2.8 P5.7 R9.1
mTMS: P1.5 P2.5 R6.1 RAN1.6(R3)
P1_3: U2.20(P1.3/TA0.2)
P1_4: U2.21(P1.4/TA0.3)
P1_5: U2.22(P1.5/TA0.4)
P1_6: U2.23(P1.6/SMCLK)
P1_7: U2.24(P1.7)
P2_1: R12.1 U2.26(P2.1/TA1.0)
P2_2: U2.27(P2.2/TA1.1)
P2_3: U2.28(P2.3/TA1.2)
P2_4: U2.29(P2.4/RTCCLK)
P2_6: U2.31(P2.6/ACLK)
P3_0: U2.33(P3.0/UCB0STE/UCA0CLK)
P3_1: U2.34(P3.1/UCB0SIMO/UCB0SDA)
P3_2: U2.35(P3.2/UCB0SOMI/UCB0SCL)
P3_3: U2.36(P3.3/UCB0CLK/UCA0STE)
P3_4: U2.39(P3.4/UCA0TXD/UCA0SIMO)  [also labelled UCA0TX]
P3_5: U2.40(P3.5/UCA0RXD/UCA0SOMI)  [also labelled UCA0RX]
P3_6: U2.41(P3.6/UCB1STE/UCA1CLK)
P3_7: U2.42(P3.7/UCB1SIMO/UCB1SDA)
P4_3: U2.46(P4.3/TB0.3)
P4_4: U2.47(P4.4/TB0.4)
P4_6: U2.49(P4.6/TB0.6)
P5_1: U2.10(P5.1/A9/VREF-/VeREF-)
P5_6: U2.53(P5.6/UCA1TXD/UCA1SIMO)  [also labelled UCA2TX]
P5_7: U2.54(P5.7/UCA1RXD/UCA1SOMI)  [also labelled UCA2RX]
P6_0: U2.97(P6.0/A0)
P6_1: U2.98(P6.1/A1)
P6_2: U2.99(P6.2/A2)
P6_4: U2.1(P6.4/A4)
P6_5: U2.2(P6.5/A5)
P6_6: U2.3(P6.6/A6)
P6_7: U2.4(P6.7/A7)
P7_5: U2.6(P7.5/A13)
P7_6: U2.7(P7.6/A14)
P7_7: U2.8(P7.7/A15)
P8_2: U2.59(P8.2/TA0.2)
P8_3: U2.60(P8.3/TA0.3)
P8_4: U2.61(P8.4/TA0.4)
P8_5: U2.65(P8.5/TA1.0)
P8_6: U2.66(P8.6/TA1.1)  [also labelled SPI_PWR]
P8_7: U2.67(P8.7)
P9_4: U2.72(P9.4/UCA2TXD/UCA2SIMO)
P9_5: U2.73(P9.5/UCA2RXDUCA2SOMI)
P9_6: U2.74(P9.6)
P9_7: U2.75(P9.7)
P10_1: U2.77(P10.1/UCB3SIMO/UCB3SDA)  [also labelled UCB3SDA]
P10_2: U2.78(P10.2/UCB3SOMI/UCB3SCL)  [also labelled UCB3SCL]
P10_3: U2.79(P10.3/UCB3CLK/UCA3STE)
P10_4: U2.80(P10.4/UCA3TXD/UCA3SIMO)  [also labelled UCA3TX]
P10_5: U2.81(P10.5/UCA3RXDUCA3SOMI)  [also labelled UCA3RX]
P10_6: U2.82(P10.6)
P10_7: U2.83(P10.7)
P11_0: U2.84(P11.0/ACLK)
P11_1: U2.85(P11.1/MCLK)
P11_2: U2.86(P11.2/SMCLK)
POWER_UP: U2.25(P2.0/TA1CLK/MCLK)
REF+: U2.9(P5.0/A8/VREF+/VeREF+)
SYSON: U2.51(P5.4/UCB1SOMI/UCB1SCL)
WDI: U2.5(P7.4/A12)
xRST: D3.2(K)
XTAL2_IN: C36.1 RN1.2 U2.89(P5.2/XT2IN) X4.3(OSC2)
XTAL2_OUT: C37.1 RN1.1 U2.90(P5.3/XT2OUT) X4.1(OSC1)
XTAL_IN: R14.2 U2.13(P7.0/XIN) X3.2(OSC2)
XTAL_OUT: R14.1 U2.14(P7.1/XOUT) X3.1(OSC1)
xTCK: RAN1.4(R4)
xTDI: RAN1.2(R2)
xTDO: RAN1.1(R1)
xTMS: RAN1.3(R3)
NetC31_1: C31.1 R10.2 U2.11(AVCC)
NetC34_1: C34.1 U2.62(VCORE)
NetCP8_1: CP8.1 LR2.2 U3.2(Vout)
NetD2_1: D2.1(A) P1.2
NetR5_1: R5.1 U2.95(PJ.3/TCK)
NetR6_2: R6.2 U2.94(PJ.2/TMS)
NetR7_2: R7.2 U2.93(PJ.1/TDI/TCLK)
NetR8_2: R8.2 U2.92(PJ.0/TDO)
NetR9_2: R9.2 U2.91(TEST/SBWTCK)
NetR11_2: R11.2 S1.2
NetR12_2: R12.2 R13.2 S1.1

Not connected (* = marked no-connect by the designer): P1 6 10 12 13 14; P4 2 3 4 5 6 8 10 11 12 13 14; RF2 1; U2 17(P1.0/TA0CLK/ACLK) 52(P5.5/UCB1CLK/UCA1STE) 55(P7.2/TB0OUTH/SVMOUT) 56(P7.3/TA1.2) 58(P8.1/TA0.1)

### Notes on the sheet
- 1N4148W SOD123 0.15A Max0.5A
- 1N4148WS SOD323 Max0.3A
- 1N4148WT SOD523
- LL4148W  Mini MELF
- (near P1) VJTAG 给Jtag供电端口
- BATOFF 电池关闭 默认关闭 低电平打开
- SYSOFF 系统关闭 默认开启 高电平打开
- (near U2) 上电唤醒
- VCORE电容必须接，否则单片机运行不稳定
- (near U2) 中断P1、P2
- Vo=0.6*(1+Ru/Rd)
- (near R12) 常闭,震动断开
- (near U2) AS1353 LP3985替换
- (near U3) Imax=150mA
- (near C36) 震动 下降沿
- 开盖光感唤醒
- 电话唤醒
- GPS定位
- 1.上电唤醒MAX706
- 2.开盒检测_MAX931ESA
- (near CP8) I=4mA
- 1.震动唤醒
- 2.
- Labels drawn without touching a wire or pin: BAT, GGND, GPS_BAT, GPS_DET, GPS_WAKE, P2_6, P2_7, P4_5, P4_7, P7_4, VBAT, ~{PGOOD}

### Library data of the parts
C29-C35 = CAP: as C66 on sheet 06-Key; Category: 多层陶瓷电容器MLCC - SMD/SMT; ComponentLink1Description: http://www.tdk.com/pdf/general_B11.pdf; ComponentLink1URL: http://www.tdk.com/pdf/general_B11.pdf; Description 1: 多层陶瓷电容器MLCC - SMD/SMT 0603 0.1uF 50volts X7R 10%; Manufacturer Part Number: C1608X7R1H104K; Minimum Order Quantity: 1; Pricing 1: 1=0.160, 50=0.070, 100=0.036, 500=0.019, 1000=0.013, 4000=0.010, 8000=0.009, 12000=0.008, 20000=0.007 (USD); Reeling: True; RoHS - 贸泽: Y; RoHS: RoHS Compliant; Stock 1: 224604; Supplier 1: Mouser; Supplier Part Number 1: 810-C1608X7R1H104K; 制造商: TDK; 容差: 10 %; 温度系数/代码: X7R; 电容: 0.1 uF; 端接类型: SMD/SMT
C36 C37 = CAP: 多层陶瓷电容器MLCC - SMD/SMT 0603 15pF 50volts C0G 5%; Manufacturer: TDK; 尺寸: 0.8 mm W x 1.6 mm L x 0.8 mm H; 工作温度范围: - 55 C to + 125 C; 封装 / 箱体: 0603 (1608 metric); 封装: Reel; 产品: General Type MLCCs; 系列: C; 电压额定值: 50 V; 外壳代码 - in: 0603; 外壳代码 - mm: 1608; 产品种类: Low & Medium Capacitance SMD Ceramic Chip Capacitors; 标准包装数量: 4000; 温度系数/代码: C0G (NP0); Supplier 1: Mouser; Supplier Part Number 1: 810-C1608C0G1H150J; Manufacturer Part Number: C1608C0G1H150J; RoHS: RoHS Compliant; Description 1: 多层陶瓷电容器MLCC - SMD/SMT 0603 15pF 50volts C0G 5%; Category: 多层陶瓷电容器MLCC - SMD/SMT; Stock 1: 9174; Pricing 1: 1=0.090, 50=0.020, 100=0.013, 500=0.008, 1000=0.007, 4000=0.007, 8000=0.006, 12000=0.005, 20000=0.004 (USD); 电容: 15 pF; 端接类型: SMD/SMT; 容差: 5 %; 制造商: TDK; RoHS - 贸泽: Y; Minimum Order Quantity: 1; Reeling: True; ComponentLink1URL: http://www.tdk.com/pdf/general_B11.pdf; ComponentLink1Description: http://www.tdk.com/pdf/general_B11.pdf
CP7 CP8 = CAPACITOR: as CP16 on sheet 06-Key; Category: 钽质电容器-固体SMD; ComponentLink1Description: http://www.avx.com/docs/Catalogs/taj.pdf; ComponentLink1URL: http://www.avx.com/docs/Catalogs/taj.pdf; Description 1: 钽质电容器-固体SMD 16volts 10uF 10%; Manufacturer Part Number: TAJA106K016RNJ; Minimum Order Quantity: 1; Pricing 1: 1=0.600, 100=0.280, 200=0.250, 500=0.221, 1000=0.200, 2000=0.140, 5000=0.131, 10000=0.124, 25000=0.103 (USD); Reeling: True; RoHS - 贸泽: Y; RoHS: RoHS Compliant; Stock 1: 20335; Supplier 1: Mouser; Supplier Part Number 1: 581-TAJA106K016R; 制造商: AVX; 容差: 10 %; 电容: 10 uF
D2 D3 = 1N4148W: 二极管 - 通用，功率，开关 100V Io/150mA; Manufacturer: Vishay Semiconductors; 配置: Single; 工作温度范围: - 65 C to + 150 C; 封装 / 箱体: SOD-123; 封装: Reel; 产品: Switching Diodes; 正向连续电流: 0.15 A; 最大浪涌电流: 0.5 A; 安装风格: SMD/SMT; 恢复时间: 4 ns; 正向电压下降: 1.2 V; 制造商: Vishay; 最大二极管电容: 4 pF; 最大工作温度: + 150 C; 最大功率耗散: 350 mW; 最大反向漏泄电流: 5 uA; 最小工作温度: - 65 C; 标准包装数量: 15000; Supplier 1: Mouser; Supplier Part Number 1: 625-1N4148W-V; Manufacturer Part Number: 1N4148W-V-GS08; RoHS: RoHS Compliant; Category: 二极管 - 通用，功率，开关; Stock 1: 404148; Pricing 1: 1=0.090, 10=0.083, 50=0.072, 100=0.068, 500=0.032, 1000=0.026, 3000=0.021, 9000=0.016, 10000=0.016, 18000=0.014 (USD); 峰值反向电压: 100 V; 产品种类: Switching Diodes; RoHS - 贸泽: Y; Minimum Order Quantity: 1; Reeling: True; ComponentLink1URL: http://www.mouser.com/ds/2/427/1n4148w--240387.pdf; ComponentLink1Description: http://www.mouser.com/ds/2/427/1n4148w--240387.pdf; Description 1: 二极管 - 通用，功率，开关 100V Io/150mA
LR2 = Res Semi: as LR7 on sheet 08-IIC; Supplier 1: Mouser; Supplier Part Number 1: 810-MPZ2012S221A; Manufacturer Part Number: MPZ2012S221A; RoHS: RoHS Compliant; Description 1: 电磁干扰滤波珠子、扼流圈和阵列 Ferrite Chip Beads; Category: 电磁干扰滤波珠子、扼流圈和阵列; Stock 1: 26540; Pricing 1: 1=0.070, 50=0.060, 100=0.053, 500=0.040, 1000=0.035, 4000=0.031, 8000=0.029, 12000=0.025 (USD); 制造商: TDK; RoHS - 贸泽: Y; Minimum Order Quantity: 1; Reeling: True; ComponentLink1URL: http://www.mouser.com/ds/2/400/e9413_mpz-24582.pdf; ComponentLink1Description: http://www.mouser.com/ds/2/400/e9413_mpz-24582.pdf
P1 P4 = Header 7X2: TE CONNECTIVITY 2.54mm / AMP - 0-281272-1 - HEADER STRAIGHT 14WAY; Manufacturer: TE CONNECTIVITY / AMP; Description 1: TE CONNECTIVITY / AMP - 0-281272-1 - HEADER STRAIGHT 14WAY; Product Range: TE - AMP-LATCH Series; Contact Termination: Through Hole Vertical; No. of Contacts: 14; No. of Rows: 2; Pitch Spacing: 2.54; Supplier 1: Farnell; Supplier Part Number 1: 3816266; Manufacturer Part Number: 0-281272-1; RoHS: YES; Stock 1: 25; Pricing 1: 1=6.14 (CNY); Gender: Header; Contact Plating: Gold; Contact Material: Brass; Lead Spacing: 2.54; Termination Method: Solder; ComponentLink1URL: http://www.farnell.com/cad/1656189.pdf; ComponentLink1Description: http://www.farnell.com/cad/1656189.pdf; ComponentLink2URL: http://www.farnell.com/datasheets/55305.pdf; ComponentLink2Description: http://www.farnell.com/datasheets/55305.pdf
P2 P5 = Header 4X2: 插针 Header, 4-Pin, Dual row; LatestRevisionDate: 17-Jul-2002; LatestRevisionNote: Re-released for DXP Platform.; Publisher: Altium Limited
P3 = Header 4: 插针 Header, 4-Pin; LatestRevisionDate: 17-Jul-2002; LatestRevisionNote: Re-released for DXP Platform.; Publisher: Altium Limited
R4 = RES: as R79 on sheet 06-Key; Supplier 1: Mouser; Supplier Part Number 1: 71-CRCW0603-10K-E3; Manufacturer Part Number: CRCW060310K0FKEA; RoHS: RoHS Compliant By Exemption; Category: 厚膜电阻器 - SMD; Stock 1: 0; Pricing 1: 1=0.080, 10=0.013, 100=0.010, 1000=0.008, 5000=0.005, 25000=0.004, 50000=0.003 (USD); 电阻: 10 kOhms; 容差: 1 %; RoHS - 贸泽: E; Minimum Order Quantity: 1; Reeling: True; ComponentLink1URL: http://www.mouser.com/ds/2/427/dcrcwe3-109170.pdf; ComponentLink1Description: http://www.mouser.com/ds/2/427/dcrcwe3-109170.pdf; Description 1: 厚膜电阻器 - SMD 1/10watt 10Kohms 1%
R5-R9 R12 = RES: as R59 on sheet 01-USB Device; Supplier 1: Mouser; Supplier Part Number 1: 71-CRCW0603-1.0K-E3; Manufacturer Part Number: CRCW06031K00FKEA; RoHS: RoHS Compliant By Exemption; Category: 厚膜电阻器 - SMD; Stock 1: 276938; Pricing 1: 1=0.080, 10=0.013, 100=0.010, 1000=0.008, 5000=0.005, 25000=0.004, 50000=0.003 (USD); 容差: 1 %; RoHS - 贸泽: E; Minimum Order Quantity: 1; Reeling: True; ComponentLink1URL: http://www.mouser.com/ds/2/427/dcrcwe3-109170.pdf; ComponentLink1Description: http://www.mouser.com/ds/2/427/dcrcwe3-109170.pdf; Description 1: 厚膜电阻器 - SMD 1/10watt 1.0Kohms 1%
R10 = RES: 厚膜电阻器 - SMD 1/10watt ZEROohm Jumper; Manufacturer: Vishay / Dale; 尺寸: 0.85 mm W x 1.55 mm L x 0.45 mm H; 工作温度范围: - 55 C to + 155 C; 封装 / 箱体: 0603 (1608 metric); 封装: Reel; 功率额定值: 100 mW; 产品: Thick Film Resistors Zero-Ohm; 电阻: 0 Ohms; 系列: CRCW; 温度系数: 200 PPM / C; 端接类型: SMD/SMT; 容差: 1 %; 电压额定值: 75 V; 外壳代码 - in: 0603; 外壳代码 - mm: 1608; 制造商: Vishay; 产品种类: 0603 Thick Film Chip Resistors; 标准包装数量: 5000; Supplier 1: Mouser; Supplier Part Number 1: 71-CRCW0603-0; Manufacturer Part Number: CRCW06030000ZSTA; RoHS: No; Category: 厚膜电阻器 - SMD; Stock 1: 44945; Pricing 1: 1=0.110, 10=0.064, 100=0.036, 1000=0.024, 5000=0.010, 10000=0.009, 25000=0.008, 50000=0.006 (USD); RoHS - 贸泽: N; Minimum Order Quantity: 1; Reeling: True; ComponentLink1URL: http://www.mouser.com/ds/2/427/dcrcw-72725.pdf; ComponentLink1Description: http://www.mouser.com/ds/2/427/dcrcw-72725.pdf; Description 1: 厚膜电阻器 - SMD 1/10watt ZEROohm Jumper
R11 = RES: 厚膜电阻器 - SMD 1/10watt 300Kohms 1%; Manufacturer: Vishay / Dale; Manufacturer Part Number: CRCW0603100KFKEA; 尺寸: 0.85 mm W x 1.55 mm L x 0.45 mm H; 工作温度范围: - 55 C to + 155 C; 封装 / 箱体: 0603 (1608 metric); 封装: Reel; 功率额定值: 100 mW; 产品: Thick Film Resistors SMD; 电阻: 100 kOhms; 系列: CRCW; 温度系数: 100 PPM / K; 端接类型: SMD/SMT; 电压额定值: 75 V; 制造商: Vishay; 产品种类: 0603 Thick Film Chip Resistors; 标准包装数量: 5000; Description 1: 厚膜电阻器 - SMD 1/10watt 100Kohms 1%; 外壳代码 - in: 0603; 外壳代码 - mm: 1608; Supplier 1: Mouser; Supplier Part Number 1: 71-CRCW0603-100K-E3; RoHS: RoHS Compliant By Exemption; Category: 厚膜电阻器 - SMD; Stock 1: 175756; Pricing 1: 1=0.080, 10=0.013, 100=0.010, 1000=0.008, 5000=0.005, 25000=0.004, 50000=0.003 (USD); 容差: 1 %; RoHS - 贸泽: E; Minimum Order Quantity: 1; Reeling: True; ComponentLink1URL: http://www.mouser.com/ds/2/427/dcrcwe3-109170.pdf; ComponentLink1Description: http://www.mouser.com/ds/2/427/dcrcwe3-109170.pdf
R13 R14 RN1 = RES: 厚膜电阻器 - SMD 1/10watt 1.0Mohms 1%; Manufacturer: Vishay / Dale; 尺寸: 0.85 mm W x 1.55 mm L x 0.45 mm H; 工作温度范围: - 55 C to + 155 C; 封装 / 箱体: 0603 (1608 metric); 封装: Reel; 功率额定值: 100 mW; 产品: Thick Film Resistors SMD; 电阻: 1 MOhms; 系列: CRCW; 温度系数: 100 PPM / K; 端接类型: SMD/SMT; 电压额定值: 75 V; 外壳代码 - in: 0603; 外壳代码 - mm: 1608; 制造商: Vishay; 产品种类: 0603 Thick Film Chip Resistors; 标准包装数量: 5000; Supplier 1: Mouser; Supplier Part Number 1: 71-CRCW0603-1.0M-E3; Manufacturer Part Number: CRCW06031M00FKEA; RoHS: RoHS Compliant By Exemption; Category: 厚膜电阻器 - SMD; Stock 1: 71394; Pricing 1: 1=0.080, 10=0.013, 100=0.010, 1000=0.008, 5000=0.005, 25000=0.004, 50000=0.003 (USD); 容差: 1 %; RoHS - 贸泽: E; Minimum Order Quantity: 1; Reeling: True; ComponentLink1URL: http://www.mouser.com/ds/2/427/dcrcwe3-109170.pdf; ComponentLink1Description: http://www.mouser.com/ds/2/427/dcrcwe3-109170.pdf; Description 1: 厚膜电阻器 - SMD 1/10watt 1.0Mohms 1%
RAN1 = RP4R: 电阻器网络与阵列 8Term 22ohms 5% Convex; Manufacturer: Vishay / Dale; 尺寸: 1.5 mm W x 1.6 mm L x 0.5 mm H; 工作温度范围: - 55 C to + 150 C; 封装: Reel; 系列: CRA06; 温度系数: 200 PPM / K; 端接类型: SMD/SMT; 电路类型: Isolated; 管脚数量: 8; 电阻器数量: 4; 引线间隔: 0.8 mm; 制造商: Vishay; 产品种类: Thick Film Resistor Arrays; 产品类型: Arrays; Supplier 1: Mouser; Supplier Part Number 1: 71-CRA06S08322R0JTA; Manufacturer Part Number: CRA06S08322R0JTA; RoHS: RoHS Compliant By Exemption; Description 1: 电阻器网络与阵列 8Term 22ohms 5% Convex; Category: 电阻器网络与阵列; Stock 1: 1674; Pricing 1: 1=0.090, 100=0.080, 500=0.070, 1000=0.056, 5000=0.051, 10000=0.050, 25000=0.044 (USD); 容差: 5 %; 电阻数值: 22 Ohms; RoHS - 贸泽: E; Minimum Order Quantity: 1; Reeling: True; ComponentLink1URL: http://www.mouser.com/ds/2/427/cra06es-73101.pdf; ComponentLink1Description: http://www.mouser.com/ds/2/427/cra06es-73101.pdf
RF2 = FUSE1: as RF3 on sheet 01-USB Device; Supplier 1: Mouser; Supplier Part Number 1: 576-0805L050; Manufacturer Part Number: 0805L050WR; RoHS: RoHS Compliant; Category: Resettable Fuses - PPTC; Stock 1: 4103; Pricing 1: 1=3.25, 10=2.61, 50=2.39, 100=2.12, 200=2.07, 500=1.74, 1000=1.49, 3000=1.40, 6000=1.35 (AUD); Dimensions: 2.2 mm L x 1.5 mm W x 1.25 mm  H; Operating Temperature Range: - 40 C to + 85 C; Package / Case: 0805 (2012 metric); Packaging: Reel; Series: 0805L; Termination Style: SMD/SMT; Type: PolyFuse Resettable PTC; Mounting Style: SMD/SMT; Product Category: Resettable PTCs; Standard Pack Qty: 3000; RoHS - Mouser: Y; Minimum Order Quantity: 1; Reeling: True; ComponentLink1URL: http://www.mouser.com/ds/2/240/Littelfuse_0805L-32472.pdf; ComponentLink1Description: http://www.mouser.com/ds/2/240/Littelfuse_0805L-32472.pdf
S1 = Header 2: 插针 工业级震动传感器; 公司: 百灵电子; LatestRevisionDate: 17-Jul-2002; LatestRevisionNote: Re-released for DXP Platform.; Publisher: Altium Limited
TP1 = Test Point
U2 = MSP430F5438: IC MCU 16BIT 256K FLASH 100-LQFP; Manufacturer: Texas Instruments; Manufacturer Part Number: MSP430F5438IPZR; 公司: TI; Core Size: 16-Bit; Speed: 18MHz; Connectivity: I2C, IrDA, LIN, SCI, SPI, UART/USART; Peripherals: Brown-out Detect/Reset, DMA, POR, PWM, WDT; Number of I /O: 87; Program Memory Size: 256KB (256K x 8); RAM Size: 16K x 8; Voltage - Supply (Vcc/Vdd): 2.2 V ~ 3.6 V; Data Converters: A/D 16x12b; Oscillator Type: External; Supplier 1: Digi-Key; Supplier Part Number 1: 296-23859-1-ND; RoHS: RoHS Compliant; Description 1: IC MCU 16BIT 256K FLASH 100-LQFP; Category: Integrated Circuits (ICs); Stock 1: 10552; Pricing 1: 1=9.98, 10=8.978, 25=8.1656, 100=7.3917, 250=6.77252, 500=6.192 (USD); Packaging: Cut Tape (CT); Core Processor: -; Program Memory Type: FLASH; EEPROM Size: -; Operating Temperature: -40°C ~ 85°C; Package / Case: 100-LQFP; ComponentLink1URL: http://www.ti.com/lit/ds/symlink/msp430f5438.pdf; ComponentLink1Description: http://www.ti.com/lit/ds/symlink/msp430f5438.pdf
U3 = Volt Reg: LDO Voltage Controllers; Manufacturer: ams; Input Voltage MAX: 20 V; Output Current: 150 mA; Output Voltage: 3.3 V; Product Status: New at Mouser; Supplier 1: Mouser; Supplier Part Number 1: 985-AS1360-33-T; Manufacturer Part Number: AS1360-33-T; RoHS: RoHS Compliant; Category: LDO Voltage Controllers; Stock 1: 4086; Pricing 1: 1=1.82, 10=1.46, 100=1.12, 500=0.991, 1000=0.783, 2500=0.730, 5000=0.695, 10000=0.680 (AUD); Package / Case: SOT-23-3; Packaging: Reel; Mounting Style: SMD/SMT; Maximum Operating Temperature: + 85 C; Minimum Operating Temperature: - 40 C; RoHS - Mouser: Y; Minimum Order Quantity: 1; Reeling: True; ComponentLink1URL: http://ams.com/eng/content/download/1325/7334/424; ComponentLink1Description: http://ams.com/eng/content/download/1325/7334/424
X3 = XTAL: 晶体 32.768KHz 20ppm 12.5pF -40C -85C; Manufacturer: Epson Toyocom; 尺寸: 1.5 mm W x 3.2 mm L x 0.8 mm H; 工作温度范围: - 40 C to + 85 C; 封装: Bulk; 系列: FC; 端接类型: SMD/SMT; ESR: 70 KOhms; 制造商: Epson; 产品种类: .; Supplier 1: Mouser; Supplier Part Number 1: 732-FC135-32.76KAA; Manufacturer Part Number: FC-135 32.7680KA-A; RoHS: RoHS Compliant; Description 1: 晶体 32.768KHz 20ppm 12.5pF -40C -85C; Category: 晶体; Stock 1: 0; Pricing 1: 1=1.16, 10=0.900, 100=0.855, 500=0.765, 1000=0.674, 2500=0.652, 5000=0.629, 10000=0.607 (USD); 频率: 32.768 kHz; 频率稳定性: 20 PPM; 负载电容: 12.5 pF; RoHS - 贸泽: Y; Minimum Order Quantity: 1; Reeling: False; ComponentLink1URL: http://www.eea.epson.com/portal/pls/portal/docs/1/1349455.PDF; ComponentLink1Description: http://www.eea.epson.com/portal/pls/portal/docs/1/1349455.PDF
X4 = XTAL: CRYSTAL 16MHZ 18PF SMD; Manufacturer: EPSON; Frequency Stability: ±30ppm; Frequency Tolerance: ±50ppm; ESR (Equivalent Series Resistance): 80 Ohm; Operating Mode: Fundamental; Supplier 1: Digi-Key; Supplier Part Number 1: SER3686CT-ND; Manufacturer Part Number: FA-238 16.0000MB-C3; RoHS: RoHS Compliant; Description 1: CRYSTAL 16MHZ 18PF SMD; Category: Crystals and Oscillators; Stock 1: 2666; Pricing 1: 1=0.69, 10=0.579, 50=0.5192, 100=0.462 (USD); Packaging: Cut Tape (CT); Type: MHz Crystal; Frequency: 16MHz; Load Capacitance: 18pF; Operating Temperature: -20°C ~ 70°C; Ratings: -; Mounting Type: Surface Mount; Package / Case: 4-SMD, No Lead (DFN, LCC); Size / Dimension: 0.126" L x 0.098" W (3.20mm x 2.50mm); Height: 0.028" (0.70mm); ComponentLink1URL: http://www.eea.epson.com/portal/pls/portal/docs/1/1531444.PDF; ComponentLink1Description: http://www.eea.epson.com/portal/pls/portal/docs/1/1531444.PDF